# EAGLE design load_cell_amp (EAGLE 9.5.2)
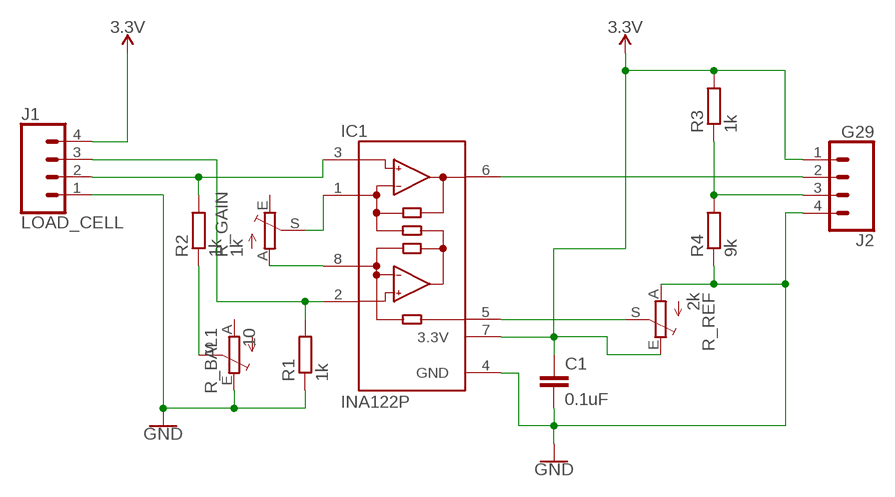
[diagram p0: schematic, sheet 1]

## Parts
C1  0.1uF  C-EU025-024X044  [C025-024X044]
IC1  INA122P  [DIL08]
J1  LOAD_CELL  M04  [04P]
J2  G29  M04  [04P]
R1  1k  R-EU_0207/10  [0207/10]
R2  1k  R-EU_0207/10  [0207/10]
R3  1k  R-EU_0207/10  [0207/10]
R4  9k  R-EU_0207/10  [0207/10]
R_BAL1  10  TRIM_EU-RJ9W  [RJ9W]
R_GAIN  1k  TRIM_EU-RJ9W  [RJ9W]
R_REF  2k  TRIM_EU-RJ9W  [RJ9W]

## Nets
3.3V: C1.1 IC1.7(3.3V) J1.4 J2.1 R3.2 R_REF.E
CLUTCH: IC1.6(OUT) J2.2
GND: C1.2 IC1.4(GND) J1.1 J2.4 R1.1 R4.1 R_BAL1.E R_REF.A
N$1: IC1.8(RG) R_GAIN.A
N$2: IC1.1(RG) R_GAIN.S
N$3: IC1.3(+IN) J1.2 R2.2
N$4: IC1.2(-IN) J1.3 R1.2
N$5: R2.1 R_BAL1.S
N$6: IC1.5(REF) R_REF.S
N$9: J2.3 R3.1 R4.2
Unconnected: R_BAL1.A R_GAIN.E

## Library data of the parts
C1 = rcl:C-EU: CAPACITOR, European symbol; SPICEPREFIX: C
IC1 = g29_load_cell:INA122: Instrumentation Amplifier Single Supply, MicroPower; MF: TEXAS INSTRUMENTS; MPN: INA122P; OC_FARNELL: 1459460; OC_NEWARK: 15M0948
J1 J2 = con-amp-quick:M04: AMP QUICK CONNECTOR; OC_FARNELL: unknown; OC_NEWARK: unknown
R1-R4 = rcl:R-EU_: RESISTOR, European symbol; SPICEPREFIX: R
R_BAL1 R_GAIN R_REF = pot:TRIM_EU-: POTENTIOMETER

## Board
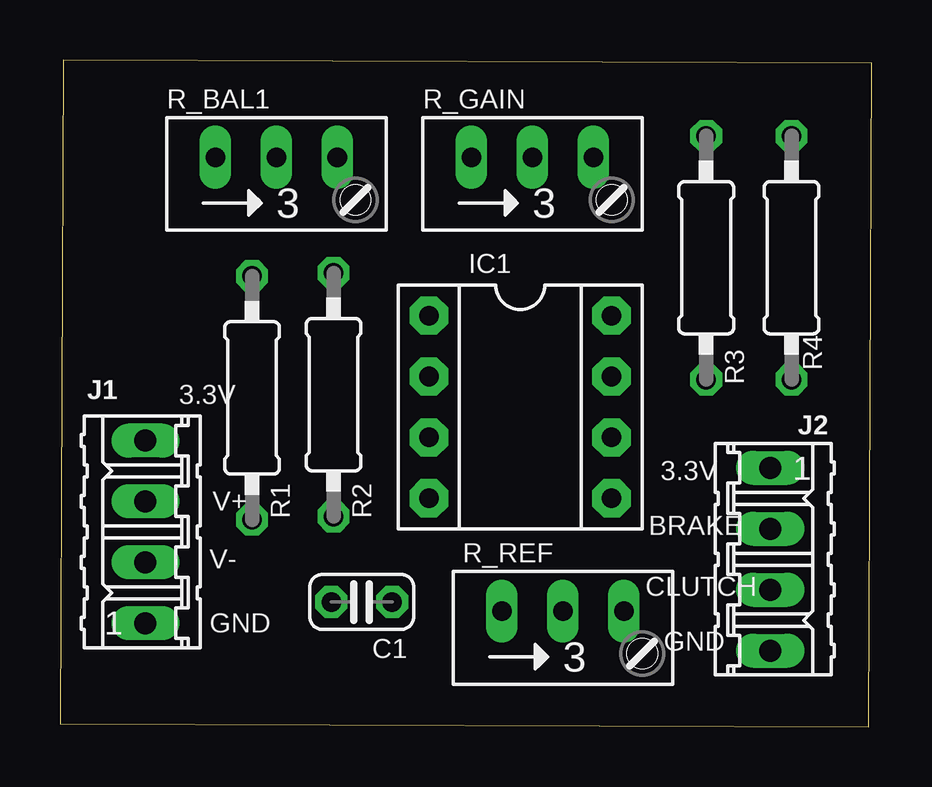
[diagram p1: board, top side]
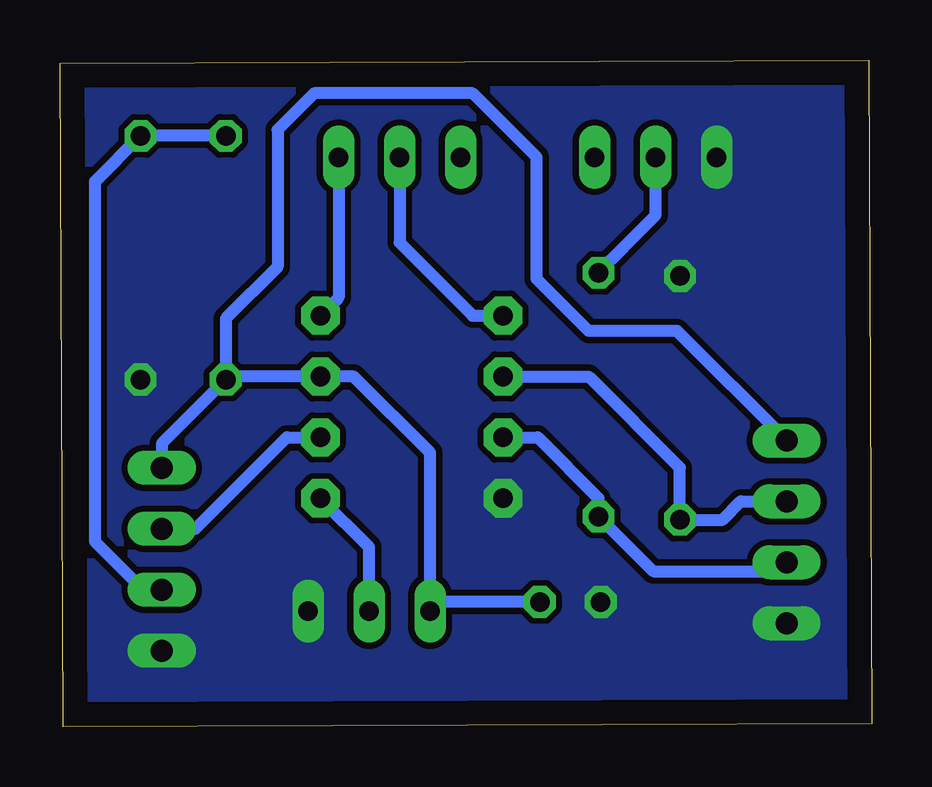
[diagram p2: board, bottom side, seen from below]

Size 33.83 x 27.8 mm. Coordinates in mm from the lower left corner, seen from the top.
Outline: 0,0.13 33.71,0 33.83,27.68 0.13,27.8 0,0.13
Copper layers (1*16): Top 0.035mm / dielectric 1.5mm / Bottom 0.035mm
Design rules "default": minimum track width 6mil, minimum drill 0.35mm, track to track 6mil, track to pad 6mil, pad to pad 6mil, via to via 6mil, smd to smd 6mil, copper to edge 40mil, drill to drill 6mil, minimum pad ring 10mil, minimum via ring 8mil, stop-mask expansion 4mil, vias tented up to drill 0mil, thermal gap 10mil

### Footprints (pad centres in the part's own frame; a part is rotated, then mirrored left to right if it is on the bottom)
C025-024X044 = drill 0.813 octagon: 1 -1.27,0; 2 1.27,0
DIL08 = drill 0.813 pad 1.6 octagon: 1 -3.81,-3.81; 2 -1.27,-3.81; 3 1.27,-3.81; 4 3.81,-3.81; 5 3.81,3.81; 6 1.27,3.81; 7 -1.27,3.81; 8 -3.81,3.81
04P = drill 0.914 long: 1 -3.81,0; 2 -1.27,0; 3 1.27,0; 4 3.81,0
0207/10 = drill 0.813 octagon: 1 -5.08,0; 2 5.08,0
RJ9W = drill 0.813 long: A 2.54,0.635; E -2.54,0.635; S 0,0.635

### Placement (x,y rotation side)
C1  12.57,5.21 180 top
IC1  19.18,13.34 270 top
J1  3.56,8.13 90 top
J2  29.59,6.98 270 top
R1  8,13.72 270 top
R2  11.4,13.85 270 top
R3  26.92,19.56 270 top
R4  30.48,19.56 90 top
R_BAL1  9.01,23.11 0 top
R_GAIN  19.68,23.11 0 top
R_REF  20.95,4.19 0 top

### Tracks (layer width: path | path; a pad name or v marks a point on that pad's centre or on a via)
3.3V
  Bottom 0.406: 26.8,14.6 R3.2
  Bottom 0.508: R3.2 29.59,11.81 J2.1 | C1.1 18.03,5.21 R_REF.E 18.41,11.43 21.59,14.6 IC1.7 26.8,14.6 26.92,14.73 26.92,17.02 24.77,19.18 24.77,24.89 23.24,26.42 16.64,26.42 13.97,23.75 13.97,18.67 11.81,16.51 8.13,16.51 J1.4
CLUTCH
  Bottom 0.508: J2.2 28.19,8.26 24.38,12.06 IC1.6
GND
  pour Bottom (isolate 0.254, no thermals): -0.86,-0.73 34.54,-0.73 34.54,27.81 -0.86,27.81
N$1
  Bottom 0.508: R_GAIN.A 22.23,17.91 IC1.8
N$2
  Bottom 0.508: R_GAIN.S 19.68,20.19 16.64,17.14 IC1.1
N$3
  Bottom 0.406: 11.4,9.53 R2.2
  Bottom 0.508: R2.2 9.11,6.48 3.93,6.48 J1.2 | IC1.3 13.93,12.06 11.4,9.53
N$4
  Bottom 0.508: J1.3 5.46,9.4 6.22,8.64 R1.2 8,10.8 11.81,14.6 IC1.2
N$5
  Bottom 0.508: R_BAL1.S 9.01,21.34 10.33,20.02 11.4,18.95 R2.1
N$6
  Bottom 0.508: R_REF.S 20.95,7.49 IC1.5
N$9
  Bottom 0.508: R3.1 R4.2 32.38,22.73 32.38,7.73 30.37,5.71 J2.3

### Text on the board
tNames: 3.3V | 3.3V | V+ | BRAKE | V- | CLUTCH | GND | GND